# EAGLE design BatteryBoard (EAGLE 9.2.2)
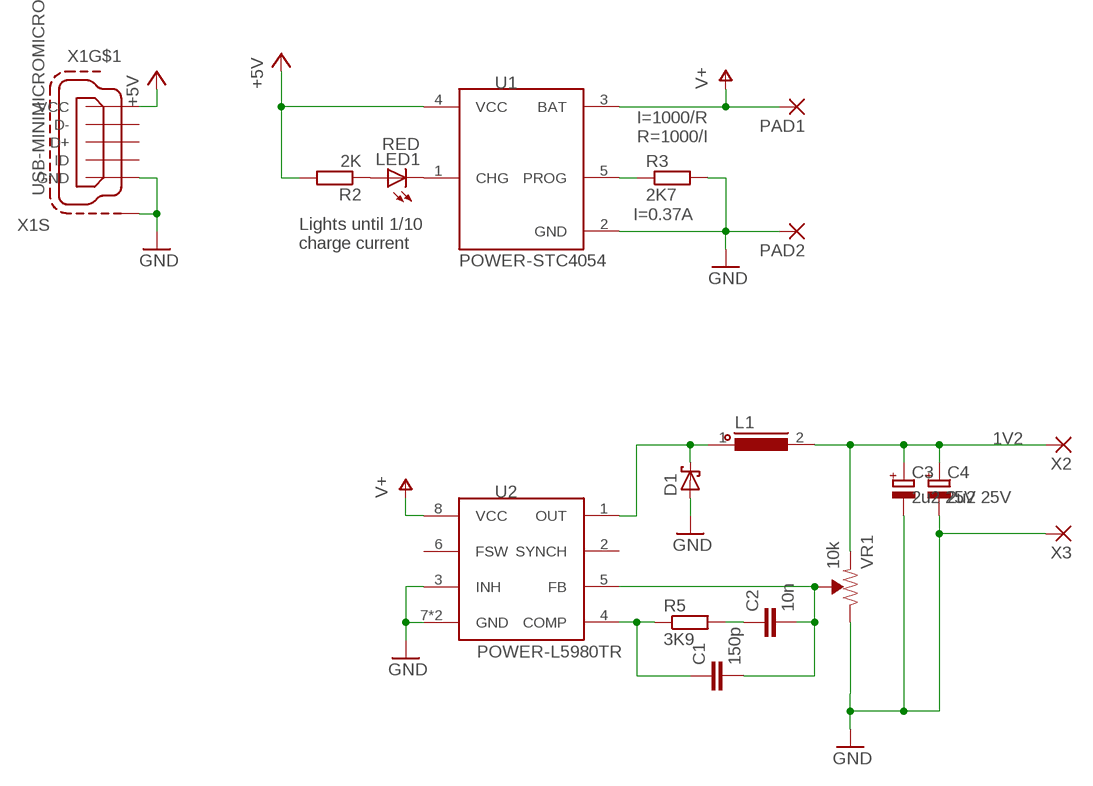
[diagram p0: schematic, sheet 1]

## Parts
C1  150p  CAP_0805  [CAP0805]
C2  10n  CAP_0805  [CAP0805]
C3  2u2 25V  CAP-POL_CAPE3216-A  [CAPMP3317X180]
C4  2u2 25V  CAP-POL_CAPE3216-A  [CAPMP3317X180]
D1  DIODE-SH_SMA  [DO214AC]
L1  INDUCTORNL4532  [INDM4232X320]
LED1  RED  LED_1206  [LED1206]
PAD1  WIREPAD-SMD2  [PAD-1.27X2.54]
PAD2  WIREPAD-SMD2  [PAD-1.27X2.54]
R2  2K  R_R0805  [RESC2012X50]
R3  2K7  R_R0805  [RESC2012X50]
R5  3K9  R_R0805  [RESC2012X50]
U1  POWER-STC4054  [SOT95P280X145-5]
U2  POWER-L5980TR  [QFPN8]
VR1  10k  TRIMPOT-SMD-3MM-OPEN-1/10W-25%  [TRIMPOT-SMD-TC33X]
X1  USB-MINIMICROMICRO  [USB-B-MICRO-SMD]
X2  WIREPAD-SMD2  [PAD-1.27X2.54]
X3  WIREPAD-SMD2  [PAD-1.27X2.54]

## Nets
1V2: C3.1(+) C4.1(+) L1.2 VR1.3(CCW) X2.P$1(P)
+5V: R2.2 U1.4(VCC) X1.VBUS(VCC)
GND: C3.2(-) C4.2(-) D1.A PAD2.P$1(P) R3.2 U1.2(GND) U2.3(INH) U2.7(GND) U2.EXP(GND) VR1.1(CW) X1.GND X1.SHIELD1(S:S1) X1.SHIELD2(S:S1) X1.SHIELD3(S:S1) X3.P$1(P)
N$1: LED1.C U1.1(CHG)
N$2: LED1.A R2.1
N$3: D1.C L1.1 U2.1(OUT)
N$5: R3.1 U1.5(PROG)
N$6: C1.2 C2.2 U2.5(FB) VR1.2(WIPER)
N$7: C2.1 R5.2
N$8: C1.1 R5.1 U2.4(COMP)
V+: PAD1.P$1(P) U1.3(BAT) U2.8(VCC)
Unconnected: U2.2(SYNCH) U2.6(FSW) X1.D+ X1.D- X1.ID

## Notes on the sheet
- I=1000/R
  R=1000/I
- I=0.37A
- Lights until 1/10
  charge current

## Library data of the parts
C1 C2 = Flamberm:CAP_
C3 C4 = Flamberm:CAP-POL_
D1 = Flamberm:DIODE-SH_
L1 = Flamberm:INDUCTOR
LED1 = Flamberm:LED_
PAD1 PAD2 X2 X3 = Flamberm:WIREPAD-SMD2: SMD PAD
R2 R3 R5 = Flamberm:R_
U1 = Flamberm:POWER-STC4054
U2 = Flamberm:POWER-L5980TR
VR1 = SparkFun-Resistors:TRIMPOT: Trimming Potentiometer (Trimpot) Three-terminal potentiometers, with an adjustable wiper and two adjustable resistors. A pot can be used to create a configurable voltage divider, or as a variable resistor. "Trimpots" are a subset of potentiometers, usually intended for "set-and-forget" applications. They're often more delicate than standard potentiometers - rated for fewer turns. Variants PTH-KNOB - PTH Trimpot w/ finger-adjustable knob Trimpot 10K with Knob <https://www.sparkfun.com/products/9806> (COM-09806) Datasheet <http://www.sparkfun.com/datasheets/Components/General/TSR-3386.pdf> SMD-3MM-CLOSED-FRAME - SMD 3mm Square Closed-Frame Trimpot Used on e.g. EasyDriver - Stepper Motor Driver <https://www.sparkfun.com/products/12779> Datasheet <http://www.bitechnologies.com/pdfs/22.pdf> (22AR10KTR) SMD-5MM - SMD 5mm Square Closed-Frame Trimpot Used on e.g. IOIO-OTG - V2.2 <https://www.sparkfun.com/products/13613> Datasheet <http://www.vishay.com/docs/51008/ts53.pdf> (TS53YL502MR10) SMD-3MM-1/10W-25% - 3mm Square Open-Frame Trimpot Used on e.g. SparkFun Shapeoko <https://www.sparkfun.com/products/13899> Datasheet <http://www.bourns.com/docs/Product-Datasheets/TC33.pdf> (TC33X-2-103E); PROD_ID: RES-12428
X1 = Flamberm:USB-MINIMICRO: MINI USB-B Conector Source: www.cypressindustries.com

## Board
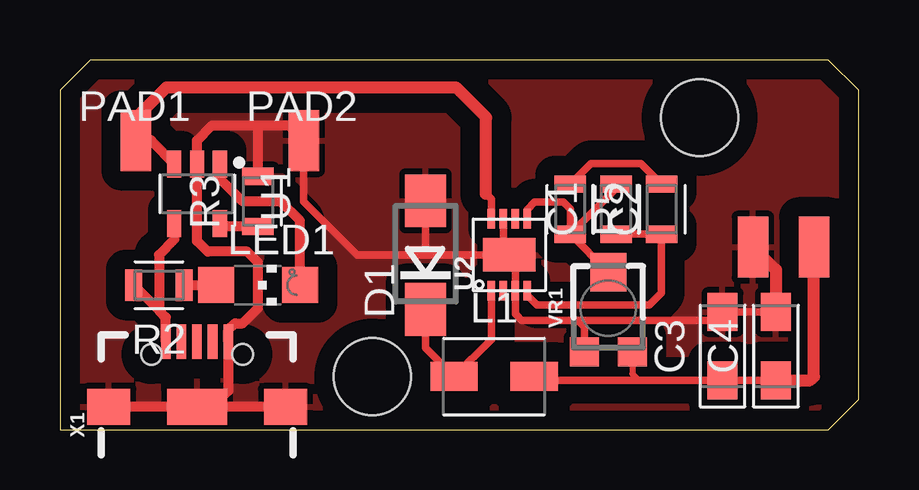
[diagram p1: board, top side]

Size 33.3 x 15.43 mm. Coordinates in mm from the lower left corner, seen from the top.
Outline: 0,0 32.03,0 33.3,1.27 33.3,14.16 32.03,15.43 1.27,15.43 0,14.16 0,0
Copper layers (1*16): Top 0.035mm / dielectric 1mm / Bottom 0.035mm
Design rules "EagleDesignRules *": minimum track width 0.25mm, minimum drill 0.3mm, track to track 0.25mm, track to pad 0.25mm, pad to pad 0.25mm, via to via 0.25mm, smd to smd 0.25mm, copper to edge 0.5mm, drill to drill 0.5mm, minimum pad ring 10mil, minimum via ring 8mil, stop-mask expansion 4mil, vias tented up to drill 0mil, thermal gap 0.25mm
Holes 3.2 mm at 13.02,2.22 26.67,13.02

### Footprints (pad centres in the part's own frame; a part is rotated, then mirrored left to right if it is on the bottom)
CAP0805 = smd 0.712 x 1.312: 1 -1.05,0; 2 1.05,0
CAPMP3317X180 = smd 1.579 x 1.25: 1 -1.425,0; 2 1.425,0
DO214AC = smd 2.2 x 1.7: A 2.25,0; C -2.285,0
INDM4232X320 = smd 1.969 x 1.212: 1 -1.671,0; 2 1.671,0
LED1206 = smd 1.5 x 1.5: A 0,-1.75; C 0,1.75
PAD-1.27X2.54 = smd 2.54 x 1.27: P$1 0,0
RESC2012X50 = smd 0.712 x 1.312: 1 -1.05,0; 2 1.05,0
SOT95P280X145-5 = smd 1.127 x 0.589: 1 -1.242,0.95; 2 -1.242,0; 3 -1.242,-0.95; 4 1.242,-0.95; 5 1.242,0.95
QFPN8 = smd 0.8 x 0.3: 1 -1.5,0.75; 2 -1.5,0.25; 3 -1.5,-0.25; 4 -1.5,-0.75; 5 1.5,-0.75; 6 1.5,-0.25; 7 1.5,0.25; 8 1.5,0.75 | smd 1.4 x 2.2: EXP 0,0
TRIMPOT-SMD-TC33X = smd 1.2 x 1.2: 1 -1,-1.825; 3 1,-1.825 | smd 1.5 x 1.6: 2 0,1.5
USB-B-MICRO-SMD = smd 1.45 x 0.4: D+ 2.725,0; D- 2.725,0.65; GND 2.725,-1.3; ID 2.725,-0.65; VBUS 2.725,1.3 | smd 1.5 x 1.8: SHIELD1 0,3.685; SHIELD2 0,-3.685 | smd 1.5 x 2.5: SHIELD3 0,0 | hole 0.85: 2.2,1.9; 2.2,-1.9

### Placement (x,y rotation side)
C1  23.18,9.21 90 top
C2  21.27,9.21 270 top
C3  27.62,3.49 90 top
C4  29.84,3.49 90 top
D1  15.24,7.3 90 top
L1  18.1,2.22 0 top
LED1  8.26,6.03 270 top
PAD1  3.17,12.06 270 top
PAD2  10.16,12.06 270 top
R2  4.13,6.03 180 top
R3  8.26,9.53 90 top
R5  25.08,9.21 90 top
U1  5.71,9.84 270 top
U2  18.73,7.3 90 top
VR1  22.86,5.08 0 top
X1  5.71,0.95 90 top
X2  31.43,7.62 90 top
X3  28.89,7.62 90 top

### Tracks (layer width: path | path; a pad name or v marks a point on that pad's centre or on a via)
1V2
  Top 0.254: VR1.3 23.86,2.34 24.13,2.07
  Top 0.305: L1.2 19.92,2.07 24.13,2.07 C3.1 C4.1 26.82,2.07
  Top 0.508: C4.1 31.28,2.07 31.43,2.22 X2.P$1
+5V
  Top 0.406: X1.VBUS 4.42,4.7 4.13,4.98 | 4.13,4.98 R2.2 | U1.4 4.76,7.94 4.13,7.3 4.13,4.98
GND
  Top 0.305: 18.41,7.61 18.1,7.3 | 18.1,7.3 18.41,7.3 | 19.06,6.98 18.98,7.05 | 18.41,7.3 U2.EXP 18.89,7.14 18.98,7.05 | 18.1,7.3 15.56,7.3 | 15.56,7.3 15.24,7.62 15.24,9.53 | 15.24,9.53 D1.A | 15.46,9.53 15.24,9.53 | C4.2 C3.2 27.28,4.57 21.59,4.57 | 19.05,4.76 19.24,4.57 21.59,4.57 | 19.05,4.76 19.06,4.77 | 15.56,7.3 12.38,7.3 10.16,9.53 PAD2.P$1 | VR1.1 21.86,4.3 21.59,4.57 | 19.05,4.76 18.98,4.83 U2.3 18.98,7.05 | U2.7 18.48,7.37 18.41,7.3
  Top 0.406: X1.SHIELD3 6.35,0.95 7.01,1.62 X1.GND 7.01,4.16 7.3,4.45 7.62,4.45 8.26,5.08 8.26,6.99 7.81,7.43 6.16,7.43 5.71,7.87 U1.2 5.71,12.06 6.35,12.7 8.26,12.7 | X1.SHIELD2 X1.SHIELD3 | X1.SHIELD3 X1.SHIELD1 | 8.26,12.7 9.53,12.7 PAD2.P$1 | R3.2 8.26,12.7
  Top 0.508: X3.P$1 29.84,6.67 C4.2
  pour Top (isolate 0.813, rank 6): 0,0 0,14.29 1.27,15.56 32.07,15.56 33.34,14.29 33.34,1.27 32.07,0
N$1
  Top 0.406: LED1.C 10.01,8.73 9.21,9.53 7.62,9.53 6.67,10.48 U1.1
N$2
  Top 0.406: R2.1 LED1.A
N$3
  Top 0.305: D1.C 15.24,3.41 L1.1 17.98,3.78 U2.1
N$5
  Top 0.406: R3.1 6.79,8.47 U1.5
N$6
  Top 0.305: C2.2 21.27,7.94 | C1.2 23.18,10.06 C2.2 | VR1.2 C2.2 | C2.2 21.27,9.21 20.98,9.5 19.79,9.5 19.48,9.2 U2.5
N$7
  Top 0.305: C2.1 22.13,11.11 24.23,11.11 R5.2
N$8
  Top 0.305: C1.1 R5.1 25.08,5.71 24.57,5.21 19.88,5.21 19.48,5.6 U2.4
V+
  Top 0.305: U2.8 17.98,9.62 17.76,9.84
  Top 0.406: PAD1.P$1 3.81,12.06 3.81,12.04 U1.3
  Top 0.508: PAD1.P$1 3.17,13.02 4.45,14.29 16.51,14.29 17.78,13.02 17.76,12.99 17.76,9.84